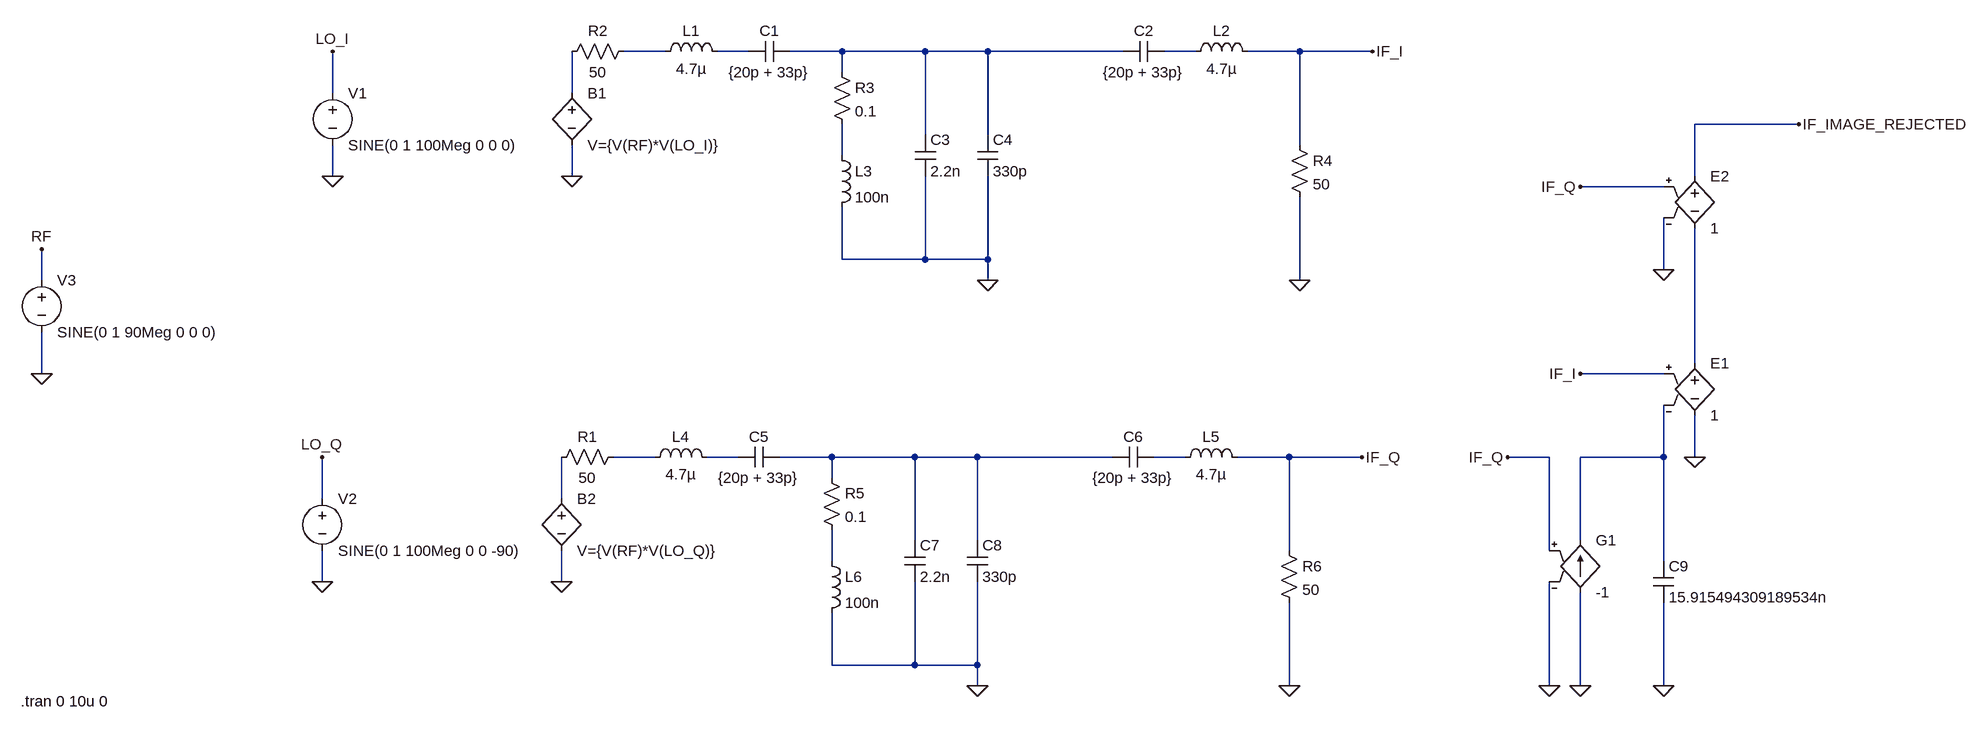
[diagram p0: schematic IQ_Sim.asc]
IQ_Sim.asc, the LTspice schematic file:
Version 4
SHEET 1 2328 1064
WIRE 320 48 256 48
WIRE 448 48 400 48
WIRE 592 48 512 48
WIRE 720 48 592 48
WIRE 816 48 720 48
WIRE 1024 48 816 48
WIRE 1136 48 1088 48
WIRE 1296 48 1216 48
WIRE 1408 48 1296 48
WIRE 592 80 592 48
WIRE -192 112 -192 48
WIRE 176 112 176 48
WIRE 2064 160 1904 160
WIRE 720 176 720 48
WIRE 816 176 816 48
WIRE 1296 192 1296 48
WIRE 592 208 592 160
WIRE -192 240 -192 192
WIRE 176 240 176 192
WIRE 1904 240 1904 160
WIRE 1856 256 1728 256
WIRE 592 368 592 288
WIRE 720 368 720 240
WIRE 720 368 592 368
WIRE 816 368 816 240
WIRE 816 368 720 368
WIRE 1856 384 1856 304
WIRE -640 400 -640 352
WIRE 816 400 816 368
WIRE 1296 400 1296 272
WIRE 1904 528 1904 320
WIRE -640 544 -640 480
WIRE 1856 544 1728 544
WIRE 304 672 240 672
WIRE 432 672 384 672
WIRE 576 672 496 672
WIRE 704 672 576 672
WIRE 800 672 704 672
WIRE 1008 672 800 672
WIRE 1120 672 1072 672
WIRE 1280 672 1200 672
WIRE 1392 672 1280 672
WIRE 1680 672 1616 672
WIRE 1856 672 1856 592
WIRE 1856 672 1728 672
WIRE 1904 672 1904 608
WIRE 576 704 576 672
WIRE -208 736 -208 672
WIRE 160 736 160 672
WIRE 704 800 704 672
WIRE 800 800 800 672
WIRE 1728 800 1728 672
WIRE 1280 816 1280 672
WIRE 1680 816 1680 672
WIRE 576 832 576 784
WIRE 1856 832 1856 672
WIRE -208 864 -208 816
WIRE 160 864 160 816
WIRE 576 992 576 912
WIRE 704 992 704 864
WIRE 704 992 576 992
WIRE 800 992 800 864
WIRE 800 992 704 992
WIRE 800 1024 800 992
WIRE 1280 1024 1280 896
WIRE 1680 1024 1680 864
WIRE 1728 1024 1728 880
WIRE 1856 1024 1856 896
FLAG 176 240 0
FLAG 160 864 0
FLAG -192 240 0
FLAG -208 864 0
FLAG -192 48 LO_I
FLAG -208 672 LO_Q
FLAG -640 544 0
FLAG -640 352 RF
FLAG 816 400 0
FLAG 1296 400 0
FLAG 1408 48 IF_I
FLAG 800 1024 0
FLAG 1280 1024 0
FLAG 1392 672 IF_Q
FLAG 1856 1024 0
FLAG 1728 1024 0
FLAG 1680 1024 0
FLAG 1616 672 IF_Q
FLAG 1904 672 0
FLAG 1728 544 IF_I
FLAG 1856 384 0
FLAG 1728 256 IF_Q
FLAG 2064 160 IF_IMAGE_REJECTED
SYMBOL bv 176 96 R0
SYMATTR InstName B1
SYMATTR Value V={V(RF)*V(LO_I)}
SYMBOL bv 160 720 R0
SYMATTR InstName B2
SYMATTR Value V={V(RF)*V(LO_Q)}
SYMBOL voltage -192 96 R0
WINDOW 123 0 0 Left 0
WINDOW 39 0 0 Left 0
SYMATTR InstName V1
SYMATTR Value SINE(0 1 100Meg 0 0 0)
SYMBOL voltage -208 720 R0
WINDOW 123 0 0 Left 0
WINDOW 39 0 0 Left 0
SYMATTR InstName V2
SYMATTR Value SINE(0 1 100Meg 0 0 -90)
SYMBOL voltage -640 384 R0
WINDOW 123 0 0 Left 0
WINDOW 39 0 0 Left 0
SYMATTR InstName V3
SYMATTR Value SINE(0 1 90Meg 0 0 0)
SYMBOL res 256 656 R90
WINDOW 0 0 56 VBottom 2
WINDOW 3 32 56 VTop 2
SYMATTR InstName R1
SYMATTR Value 50
SYMBOL res 272 32 R90
WINDOW 0 0 56 VBottom 2
WINDOW 3 32 56 VTop 2
SYMATTR InstName R2
SYMATTR Value 50
SYMBOL ind 304 64 R270
WINDOW 0 32 56 VTop 2
WINDOW 3 5 56 VBottom 2
SYMATTR InstName L1
SYMATTR Value 4.7µ
SYMBOL cap 512 32 R90
WINDOW 0 0 32 VBottom 2
WINDOW 3 32 32 VTop 2
SYMATTR InstName C1
SYMATTR Value {20p + 33p}
SYMBOL ind 1232 64 M270
WINDOW 0 32 56 VTop 2
WINDOW 3 5 56 VBottom 2
SYMATTR InstName L2
SYMATTR Value 4.7µ
SYMBOL cap 1024 32 M90
WINDOW 0 0 32 VBottom 2
WINDOW 3 32 32 VTop 2
SYMATTR InstName C2
SYMATTR Value {20p + 33p}
SYMBOL res 576 64 R0
SYMATTR InstName R3
SYMATTR Value 0.1
SYMBOL ind 576 192 R0
SYMATTR InstName L3
SYMATTR Value 100n
SYMBOL cap 704 176 R0
SYMATTR InstName C3
SYMATTR Value 2.2n
SYMBOL cap 800 176 R0
SYMATTR InstName C4
SYMATTR Value 330p
SYMBOL res 1280 176 R0
SYMATTR InstName R4
SYMATTR Value 50
SYMBOL ind 288 688 R270
WINDOW 0 32 56 VTop 2
WINDOW 3 5 56 VBottom 2
SYMATTR InstName L4
SYMATTR Value 4.7µ
SYMBOL cap 496 656 R90
WINDOW 0 0 32 VBottom 2
WINDOW 3 32 32 VTop 2
SYMATTR InstName C5
SYMATTR Value {20p + 33p}
SYMBOL ind 1216 688 M270
WINDOW 0 32 56 VTop 2
WINDOW 3 5 56 VBottom 2
SYMATTR InstName L5
SYMATTR Value 4.7µ
SYMBOL cap 1008 656 M90
WINDOW 0 0 32 VBottom 2
WINDOW 3 32 32 VTop 2
SYMATTR InstName C6
SYMATTR Value {20p + 33p}
SYMBOL res 560 688 R0
SYMATTR InstName R5
SYMATTR Value 0.1
SYMBOL ind 560 816 R0
SYMATTR InstName L6
SYMATTR Value 100n
SYMBOL cap 688 800 R0
SYMATTR InstName C7
SYMATTR Value 2.2n
SYMBOL cap 784 800 R0
SYMATTR InstName C8
SYMATTR Value 330p
SYMBOL res 1264 800 R0
SYMATTR InstName R6
SYMATTR Value 50
SYMBOL g 1728 784 R0
SYMATTR InstName G1
SYMATTR Value -1
SYMBOL cap 1840 832 R0
SYMATTR InstName C9
SYMATTR Value 15.915494309189534n
SYMBOL e 1904 512 R0
SYMATTR InstName E1
SYMATTR Value 1
SYMBOL e 1904 224 R0
SYMATTR InstName E2
SYMATTR Value 1
TEXT -672 1048 Left 2 !.tran 0 10u 0

The netlist it stands for:
* IQ_Sim.asc
B1 N005 0 V={V(RF)*V(LO_I)}
B2 N013 0 V={V(RF)*V(LO_Q)}
V1 LO_I 0 SINE(0 1 100Meg 0 0 0)
V2 LO_Q 0 SINE(0 1 100Meg 0 0 -90)
V3 RF 0 SINE(0 1 90Meg 0 0 0)
R1 N008 N013 50
R2 N001 N005 50
L1 N001 N002 4.7µ
C1 N003 N002 {20p + 33p}
L2 IF_I N004 4.7µ
C2 N003 N004 {20p + 33p}
R3 N003 N006 0.1
L3 N006 0 100n
C3 N003 0 2.2n
C4 N003 0 330p
R4 IF_I 0 50
L4 N008 N009 4.7µ
C5 N010 N009 {20p + 33p}
L5 IF_Q N011 4.7µ
C6 N010 N011 {20p + 33p}
R5 N010 N014 0.1
L6 N014 0 100n
C7 N010 0 2.2n
C8 N010 0 330p
R6 IF_Q 0 50
G1 0 N012 IF_Q 0 -1
C9 N012 0 15.915494309189534n
E1 N007 0 IF_I N012 1
E2 IF_IMAGE_REJECTED N007 IF_Q 0 1
.tran 0 10u 0
.backanno
.end